# EasyEDA schematic SCH_EMARKER_2024-12-11.json

## Parts
612DH  NO  [DFN-1*1-4]
C1  100nF  [C0603]
C2  100nF  [C0603]
C3  100nF  [C0603]
C4  100nF  [C0603]
C5  100nF  [C0603]
C6  100nF  [C0603]
C7  100nF  [C0603]
C8  100nF  [C0603]
C9  100nF  [0402C-1]
R1  10K  [R0603]
R2  10K  [R0603]
R3  10K  [R0603]
R4  10K  [R0603]
R5  10K  [R0603]
R6  10K  [R0603]
R7  10K  [R0603]
R8  10K  [R0603]
R9  10K  [R0603]
R10  10K  [R0603]
R11  10K  [R0603]
R12  10K  [R0603]
R13  10K  [R0603]
R14  10K  [R0603]
R15  10K  [R0603]
R16  10K  [R0603]
R17  1K  [0402R]
R18  1K  [0402R]
R19  1K  [0402R]
SW1  TL-01  [SW-TH_TL-01]
SW2  TL-01  [SW-TH_TL-01]
SW3  TL-01  [SW-TH_TL-01]
SW4  TL-01  [SW-TH_TL-01]
U4  NO  [SOT-23-6]
U5  NO  [SOT-23-6]
U6  NO  [332H]
U7  NO  [SOT-23-6]
U8  NO  [PG-SOT23-3_L2.9-W1.3-P1.90-LS2.4-BR]
U9  NO  [PG-SOT23-3_L2.9-W1.3-P1.90-LS2.4-BR]
U10  NO  [PG-SOT23-3_L2.9-W1.3-P1.90-LS2.4-BR]
USB2  NO  [TYPE-C14P]
USB3  NO  [TYPE-C14P]
USB4  NO  [TYPE-C14P]
USB5  NO  [TYPE-C14P]
USB6  NO  [TYPE-C14P]
USB7  NO  [TYPE-C14P]
USB8  NO  [TYPE-C14P]
USB9  NO  [TYPE-C14P]
USB10  NO  [TYPE-C14P]
USB11  NO  [TYPE-C14P]
USB12  NO  [TYPE-C14P]
USB13  NO  [TYPE-C14P]

## Library data of the parts
612DH = -: Symbol: FS612D; Device: FS612D; Add into BOM: yes; Convert to PCB: yes; Comment_1: FS612D
C1-C8 = -: Symbol: CapAcitance; Device: CAP_0603; Convert to PCB: yes; Add into BOM: yes; Supplier Footprint: 0603; Comment_1: 0.1uF; Comment: 0.1uF
C9 = -: Symbol: 0603C; Device: 1uF; Add into BOM: yes; Convert to PCB: yes; Comment_1: 1uF
R1-R7 R9 R11-R14 = -: Symbol: 电阻; Device: Res_0603; Convert to PCB: yes; Add into BOM: yes; Supplier Footprint: 0603; Comment_1: 1K; Comment: 1K
R8 R10 R15 R16 = -: Symbol: 电阻; Device: Res_0603; Convert to PCB: yes; Add into BOM: yes; Supplier Footprint: 0603; Comment_1: 270k; Comment: 270k
R17-R19 = -: Symbol: 10K; Device: 10K; Add into BOM: yes; Convert to PCB: yes
SW1-SW4 = -: LCSC Part Name: 拨码开关插件黑色01P-1PIN间距2.54mm立式直插正拨平拨1位DIP; Supplier Part: C703787; Manufacturer: Yuandi(元迪); Supplier Footprint: 插件; JLCPCB Part Class: 扩展库; Datasheet: https://atta.szlcsc.com/upload/public/pdf/source/20200720/C703787_2E451B760729F3FFBC0D95C9F91E9AFC.pdf; Supplier: LCSC; Add into BOM: yes; Convert to PCB: yes
U4 U5 U7 = -: Symbol: FS612A-B; Device: FS612A-B; Add into BOM: yes; Convert to PCB: yes; Comment_1: FS612A-B
U6 = -: Add into BOM: yes; Convert to PCB: yes
U8-U10 = -: Symbol: fs611; Device: fs611; Add into BOM: yes; Convert to PCB: yes; Comment_1: fs611
USB2-USB13 = -: Symbol: TYPEC-14PIN(公头）; Device: TYPEC-14PIN(公头）; Add into BOM: yes; Convert to PCB: yes; Comment_1: TYPEC-14PIN(公头）

## Nets
GND: 612DH.2(GND) 612DH.5(GND) C9.2 R18.1 R19.1 SW3.2 USB9.GND USB10.GND
PGND: C1.1 C2.1 C3.1 C4.1 C5.1 C6.1 C7.1 C8.1 R1.1 R2.1 R3.1 R4.1 R6.1 R7.1 R11.1 R12.1 R13.1 R14.1 SW1.2 SW2.2 SW4.2 U4.6(GND_B) U5.6(GND_B) U6.4(GND) U6.6(FUNC) U7.6(GND_B) U8.3(GND) U9.3(GND) U10.3(GND) USB2.GND USB3.GND USB4.GND USB5.GND USB6.GND USB7.GND USB8.GND USB11.GND USB12.GND USB13.GND
DM: USB6.DM USB7.DM
DM1: USB8.DM USB13.DM
DM3: USB11.DM USB12.DM
DP: USB6.DP USB7.DP
DP1: USB8.DP USB13.DP
DP3: USB11.DP USB12.DP
Net-(612DH-1): 612DH.1(VBUS) C9.1 R17.1
Net-(612DH-3): 612DH.3(FUNC) R10.2
Net-(612DH-4): 612DH.4(CC) USB9.CC1 USB10.CC1
Net-(C1-2): C1.2 R1.2 U8.1(VBUS) USB2.CC2
Net-(C2-2): C2.2 R2.2 U9.1(VBUS) USB3.CC2
Net-(C3-2): C3.2 R5.1 U10.1(VBUS)
Net-(C4-2): C4.2 R9.1 U4.1(VBUS/VCONN)
Net-(C5-2): C5.2 R13.2 U7.1(VBUS/VCONN) USB13.CC2
Net-(C6-2): C6.2 R14.2 U5.1(VBUS/VCONN) USB8.CC2
Net-(C7-2): C7.2 R11.2 U6.3 USB11.CC2
Net-(C8-2): C8.2 R12.2 U6.1 USB12.CC2
Net-(R3-2): R3.2 USB5.CC2
Net-(R4-2): R4.2 USB4.CC2
Net-(R5-2): R5.2 USB4.VBUS USB5.VBUS
Net-(R6-2): R6.2 USB6.CC2
Net-(R7-2): R7.2 USB7.CC2
Net-(R8-1): R8.1 SW1.1
Net-(R8-2): R8.2 U4.4(FUNC)
Net-(R9-2): R9.2 USB6.VBUS USB7.VBUS
Net-(R10-1): R10.1 SW3.1
Net-(R15-1): R15.1 SW4.1
Net-(R15-2): R15.2 U5.4(FUNC)
Net-(R16-1): R16.1 SW2.1
Net-(R16-2): R16.2 U7.4(FUNC)
Net-(R17-2): R17.2 USB9.VBUS USB10.VBUS
Net-(R18-2): R18.2 USB10.CC2
Net-(R19-2): R19.2 USB9.CC2
Net-(U4-3): U4.3(CC) USB6.CC1 USB7.CC1
Net-(U5-3): U5.3(CC) U7.3(CC) USB8.CC1 USB13.CC1
Net-(U6-2): U6.2(CC) USB11.CC1 USB12.CC1
Net-(U8-2): U8.2(CC) U9.2(CC) USB2.CC1 USB3.CC1
Net-(U10-2): U10.2(CC) USB4.CC1 USB5.CC1
Net-(USB2-DM): USB2.DM USB3.DM
Net-(USB2-DP): USB2.DP USB3.DP
Net-(USB2-VBUS): USB2.VBUS USB3.VBUS
Net-(USB4-DM): USB4.DM USB5.DM
Net-(USB4-DP): USB4.DP USB5.DP
Net-(USB8-VBUS): USB8.VBUS USB13.VBUS
Net-(USB9-DM): USB9.DM USB10.DM
Net-(USB9-DP): USB9.DP USB10.DP
Net-(USB11-VBUS): USB11.VBUS USB12.VBUS

Not connected (* = marked no-connect by the designer): U4 2(NC)* 5(GND_A)*; U5 2(NC)* 5(GND_A)*; U6 5(NC)* 7(EP)*; U7 2(NC)* 5(GND_A)*

## Notes on the sheet
- 1
- 2
- 3
- 4
- 5
- 6
- A
- A
- B
- B
- C
- C
- 原理图
- emaker
- 更新日期
- 2024-12-11
- 创建日期
- 2024-11-21
- P1
- 图页
- 物料编码
- 绘制
- SINK-DEMO
- D
- 审阅
- D
- 版本
- 尺寸
- 1
- 1
- 页
- 共
- 嘉立创EDA
- V1.0
- A4
- 1
- 2
- 3
- 4
- 5
- 6
